# EAGLE design NSL_Cylon (EAGLE 5.11)
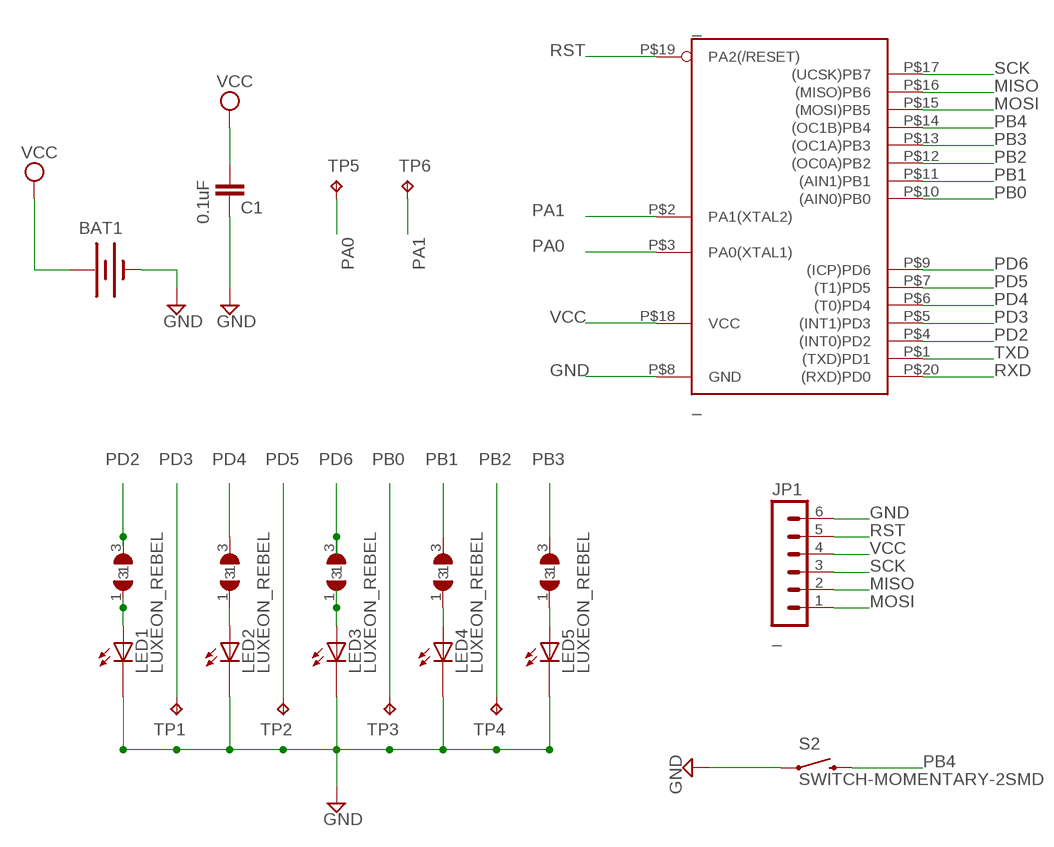
[diagram p0: schematic, sheet 1]

## Parts
_  _  TINY2313-*M*  [MLF20]
BAT1  SPARKFUN_BATTERYSPARKFUN_BATTCOMM_20MM_LINX  [SPARKFUN_BATTCOM_20MM_LINX]
C1  0.1uF  CAP0805  [0805]
JP1  _  MA06-1  [MA06-1]
LED1  LUXEON_REBEL  [LUXEON_REBEL]
LED2  LUXEON_REBEL  [LUXEON_REBEL]
LED3  LUXEON_REBEL  [LUXEON_REBEL]
LED4  LUXEON_REBEL  [LUXEON_REBEL]
LED5  LUXEON_REBEL  [LUXEON_REBEL]
S2  SWITCH-MOMENTARY-2SMD  [TACTILE_SWITCH_SMD]
TP1  TPTP10R  [TP10R]
TP2  TPTP10R  [TP10R]
TP3  TPTP10R  [TP10R]
TP4  TPTP10R  [TP10R]
TP5  TPTP10R  [TP10R]
TP6  TPTP10R  [TP10R]
U$1  0202SJ  [0202SJ]
U$2  0202SJ  [0202SJ]
U$3  0202SJ  [0202SJ]
U$4  0202SJ  [0202SJ]
U$5  0202SJ  [0202SJ]

## Nets
GND [power]: _.P$8(GND) BAT1.2(-) C1.2 JP1.6 LED1.C LED2.C LED3.C LED4.C LED5.C S2.1
MISO: _.P$16((MISO)PB6) JP1.2
MOSI: _.P$15((MOSI)PB5) JP1.1
N$1: LED3.A U$3.1
N$2: LED1.A U$1.1
N$3: LED4.A U$4.1
N$4: LED5.A U$5.1
N$5: LED2.A U$2.1
PA0: _.P$3(PA0(XTAL1)) TP5.TP
PA1: _.P$2(PA1(XTAL2)) TP6.TP
PB0: _.P$10((AIN0)PB0) TP3.TP
PB1: _.P$11((AIN1)PB1) U$4.3
PB2: _.P$12((OC0A)PB2) TP4.TP
PB3: _.P$13((OC1A)PB3) U$5.3
PB4: _.P$14((OC1B)PB4) S2.3
PD2: _.P$4((INT0)PD2) U$1.3
PD3: _.P$5((INT1)PD3) TP1.TP
PD4: _.P$6((T0)PD4) U$2.3
PD5: _.P$7((T1)PD5) TP2.TP
PD6: _.P$9((ICP)PD6) U$3.3
RST: _.P$19(PA2(/RESET)) JP1.5
RXD: _.P$20((RXD)PD0)
SCK: _.P$17((UCSK)PB7) JP1.3
TXD: _.P$1((TXD)PD1)
VCC [power]: _.P$18(VCC) BAT1.1(+) C1.1 JP1.4
Unconnected: LED1.A@1(A) LED1.C@1(C) LED2.A@1(A) LED2.C@1(C) LED3.A@1(A) LED3.C@1(C) LED4.A@1(A) LED4.C@1(C) LED5.A@1(A) LED5.C@1(C)

## Power pins joined to a net without a drawn wire
TH: LED1.TH LED1.TH@1(TH) LED1.TH@2(TH) LED1.TH@3(TH) LED1.TH@4(TH) LED2.TH LED2.TH@1(TH) LED2.TH@2(TH) LED2.TH@3(TH) LED2.TH@4(TH) LED3.TH LED3.TH@1(TH) LED3.TH@2(TH) LED3.TH@3(TH) LED3.TH@4(TH) LED4.TH LED4.TH@1(TH) LED4.TH@2(TH) LED4.TH@3(TH) LED4.TH@4(TH) LED5.TH LED5.TH@1(TH) LED5.TH@2(TH) LED5.TH@3(TH) LED5.TH@4(TH)

## Library data of the parts
_ = NSL_Cylon:TINY2313*: Atmel Tiny2313 2K Flash, 128 bytes EEPROM, 128 bytes RAM
BAT1 = NSL:SPARKFUN_BATTERY: Battery Holders Various common sizes : AA, AAA, 20mm coin cell and 12mm coin cell.
C1 = SparkFun:CAP: Capacitor Standard 0603 ceramic capacitor, and 0.1" leaded capacitor.
JP1 = con-lstb:MA06-1: PIN HEADER; OC_FARNELL: unknown; OC_NEWARK: unknown
LED1-LED5 = led-lumiled:LUXEON_REBEL: LUXEON Rebel Display layer 93, Pins, and connect all contact points with a net. The thermal pads are defined in a separate gate with addlevel REQUEST. Draw a net named 'TH' and connect all thermal pads with it. Please read the Package's Description about DRC settings. Source: http://www.lumileds.com/pdfs/AB32.pdf; OC_FARNELL: unknown; OC_NEWARK: unknown
S2 = SparkFun:SWITCH-MOMENTARY-2
TP1-TP6 = right_angle_AVR:TP: Test pad
U$1-U$5 = bv:0202SJ

## Net classes
1 power: width 0.254 mm
2 leds: width 0.508 mm

## Board
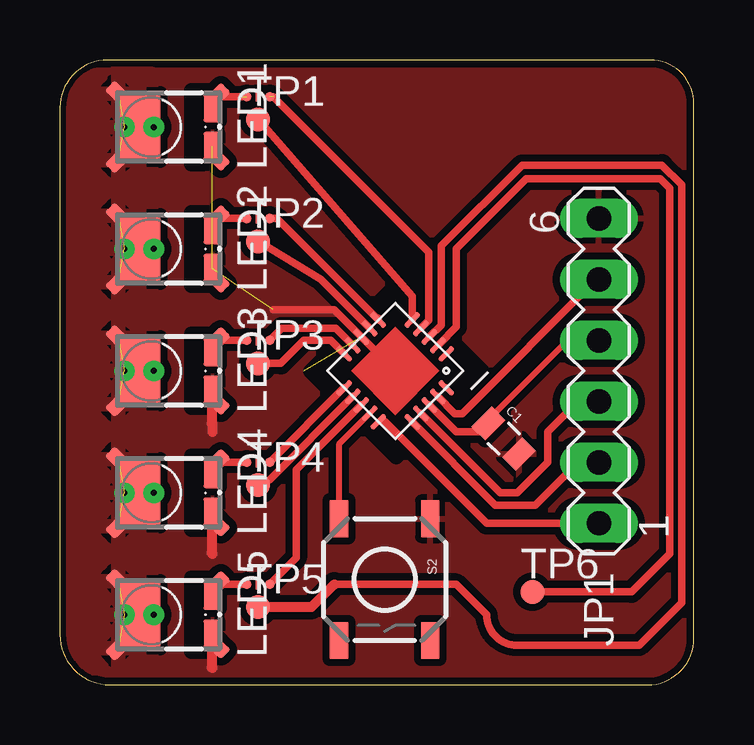
[diagram p1: board, top side]
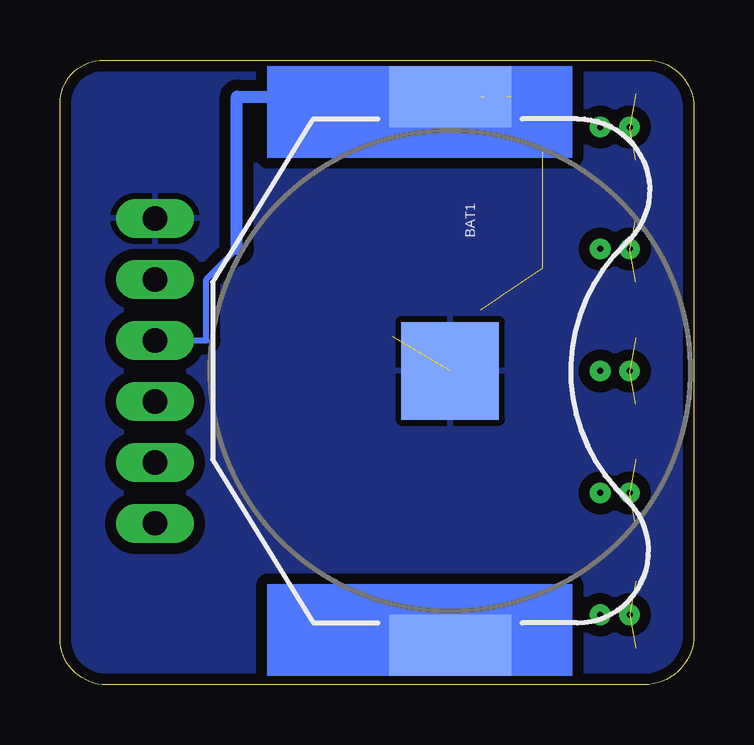
[diagram p2: board, bottom side, seen from below]

Size 26.42 x 26.04 mm. Coordinates in mm from the lower left corner, seen from the top.
Outline: 24.48,0 arc90 26.42,1.94 26.42,24.2 arc90 24.58,26.04 1.98,26.04 arc90 0,24.05 0,2.08 arc90 2.08,0 24.48,0
Copper layers (1*16): Top 0.035mm / dielectric 1.5mm / Bottom 0.035mm
Design rules "SparkFun": minimum track width 8mil, minimum drill 20mil, track to track 8mil, track to pad 8mil, pad to pad 8mil, via to via 8mil, smd to smd 8mil, copper to edge 10mil, drill to drill 8mil, minimum pad ring 12mil, minimum via ring 10mil, stop-mask expansion 4mil, vias tented up to drill 25mil, thermal gap 10mil
tRestrict: area 10.4,9.5 to 17.6,16.7
Milling: 8 lines

### Footprints (pad centres in the part's own frame; a part is rotated, then mirrored left to right if it is on the bottom)
MLF20 = smd 0.8 x 0.23: P$1 -2,1; P$2 -2,0.5; P$3 -2,0; P$4 -2,-0.5; P$5 -2,-1; P$11 2,-1; P$12 2,-0.5; P$13 2,0; P$14 2,0.5; P$15 2,1 | smd 0.23 x 0.8: P$6 -1,-2; P$7 -0.5,-2; P$8 0,-2; P$9 0.5,-2; P$10 1,-2; P$16 1,2; P$17 0.5,2; P$18 0,2; P$19 -0.5,2; P$20 -1,2
SPARKFUN_BATTCOM_20MM_LINX = smd 2.54 x 5.08: 1 -11.43,0; 3 11.43,0 | smd 4.064 x 4.064: 2 0,0
0805 = smd 0.8 x 1.2: 1 -0.9,0; 2 0.9,0
MA06-1 = drill 1.016 long: 1 -6.35,0; 2 -3.81,0; 3 -1.27,0; 4 1.27,0; 5 3.81,0; 6 6.35,0
LUXEON_REBEL = smd 1.2 x 0.67: A 0.8,-2.51; C -0.8,-2.51 | smd 1 x 0.6 rotated 315: A@1 1.31,-2.75 | smd 1 x 0.6 rotated 225: C@1 -1.31,-2.75 | smd 2.8 x 1.77: TH 0,0.51 | smd 1 x 0.6 rotated 135: TH@1 -1.39,1.39 | smd 1 x 0.6 rotated 45: TH@2 1.39,1.39 | drill 0.25 pad 0.4 round: TH@3 0,-0.095; TH@4 0,1.125
TACTILE_SWITCH_SMD = smd 1.524 x 0.762: 1 -2.54,1.905; 2 2.54,1.905; 3 -2.54,-1.905; 4 2.54,-1.905
TP10R = smd 1 x 1: TP 0,0
0202SJ = smd 0.406 x 0.406: 1 -0.475,0; 3 0.475,0 | smd 0.203 x 0.406: 2 0,0

### Placement (x,y rotation side)
_  13.97,13.08 225 top
BAT1  10.16,13.08 270 bottom
C1  18.49,10.26 315 top
JP1  22.45,13.08 90 top
LED1  3.81,23.24 90 top
LED2  3.81,18.16 90 top
LED3  3.81,13.08 90 top
LED4  3.81,8 90 top
LED5  3.81,2.92 90 top
S2  13.53,4.38 270 top
TP1  8.26,23.56 0 top
TP2  8.26,18.48 0 top
TP3  8.26,13.4 0 top
TP4  8.26,8.32 0 top
TP5  8.26,3.24 0 top
TP6  19.69,3.87 0 top
U$1  8.26,24.51 0 top
U$2  8.26,19.43 0 top
U$3  8.26,14.35 0 top
U$4  8.26,9.27 0 top
U$5  8.26,4.19 0 top

### Tracks (layer width: path | path; a pad name or v marks a point on that pad's centre or on a via)
GND  (3 unrouted)
  Top 0.305: 13.97,13.08 _.P$8 11.43,15.62 8.89,15.62
  Top 0.406: LED3.C 6.32,10.89 6.35,10.86 6.35,10.54 | LED4.C 6.32,5.49 6.35,5.46 | LED5.C 6.32,0.73 6.35,0.7
  pour Top (isolate 0.305): 26.54,-1.27 26.54,27.56 0.06,27.56 arc90 -2.29,22.68 -2.29,2.28 arc90 -1.15,-1.4
  pour Bottom (isolate 0.457): 27.94,-2.16 -2.54,-2.16 -2.54,28.32 27.94,28.32
MISO
  Top 0.254: 21.59,9.27 JP1.2
  Top 0.305: _.P$16 18.14,7.49 19.81,7.49 21.59,9.27
MOSI
  Top 0.254: _.P$15 13.55,10.96
  Top 0.305: 13.55,10.96 17.78,6.73 JP1.1
N$1
  Top 0.305: U$3.1 6.79,14.35 LED3.A
N$2  (1 unrouted)
  Top 0.305: LED1.A 6.32,24.51 7.62,24.51
N$3
  Top 0.305: U$4.1 6.79,9.27 LED4.A
N$4
  Top 0.305: U$5.1 6.79,4.19 LED5.A
N$5
  Top 0.305: U$2.1 6.79,19.43 arc90 LED2.A
PA0
  Top 0.305: _.P$3 15.88,14.99 15.88,18.29 19.26,21.65 25.08,21.65 25.91,20.83 25.91,3.43 24.13,1.65 19.05,1.65 arc-90 17.78,2.92 16.51,4.19 11.43,4.19
  Top 0.406: 11.43,4.19 10.48,3.24 TP5.TP
PA1
  Top 0.254: _.P$2 15.79,14.2
  Top 0.305: 15.79,14.2 16.51,14.92 16.51,18.16 19.43,21.08 25.02,21.08 25.4,20.7 25.4,5.46 23.81,3.87 TP6.TP
PB0
  Top 0.305: _.P$10 11.29,14.35 10.16,14.35 9.21,13.4 TP3.TP
PB1
  Top 0.305: _.P$11 11.83,12.37 U$4.3
PB2
  Top 0.305: _.P$12 8.73,8.55 TP4.TP
PB3
  Top 0.305: _.P$13 9.84,8.95 9.84,5.3 U$5.3
PB4
  Top 0.254: S2.3 11.62,10.02 _.P$14
PD2  (1 unrouted)
  Top 0.305: _.P$4 15.37,15.18 15.37,18.03 8.89,24.51
PD3
  Top 0.305: _.P$5 14.68,16.18 TP1.TP
PD4
  Top 0.254: _.P$6 13.26,15.31
  Top 0.305: _.P$6 9.03,19.43 U$2.3
PD5
  Top 0.305: TP2.TP 10.87,16.89 _.P$7
PD6
  Top 0.305: _.P$9 11.49,14.86 9.24,14.86 U$3.3
RST
  Top 0.254: 22.35,16.89 JP1.5
  Top 0.305: _.P$19 16.46,11.3 16.76,11.3 22.35,16.89
RXD
  Top 0.254: _.P$20 16.09,12.41
SCK
  Top 0.305: _.P$17 18.34,8 19.05,8 20.32,9.27 20.32,10.54 21.59,11.81 JP1.3
TH  (10 unrouted)
  pour Top: 0,25.46 0,0.7 3.81,0.7 3.81,25.46
VCC
  Top 0.254: 17.5,10.54 C1.1 17.85,11.05 21.15,14.35 JP1.4
  Top 0.305: _.P$18 16.51,10.54 17.5,10.54
  Bottom 0.254: 19.05,18.16 20.32,16.89 20.32,14.35 JP1.4
  Bottom 0.508: BAT1.1 19.05,24.51 19.05,18.16
(copper drawn outside any net)
  shapes: Bottom area x2

### Text on the board
_tsilk: i/o | CYLON | charliex | 032.la | GD | RS | o | 3V | SK | MI | MO | i/o | [NSL]